# Altium schematic sheet Connector-side-2.SchDoc: =ProjectTitle
size 297 x 209 mm; Address1: Address1; Address2: Address2; Address3: Address3; Address4: Address4; SheetNumber: 3; SheetTotal: 6; Scale: 1:1; DocumentType: Схема электрическая принципиальная
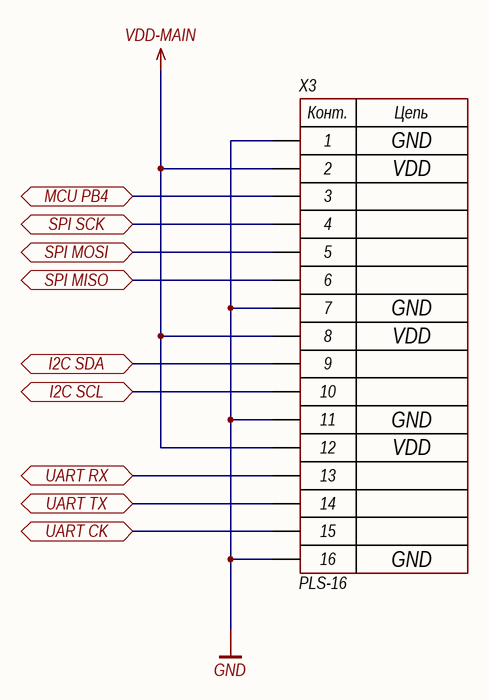
[diagram p0: Connector-side-2.SchDoc]

## Parts
X3  PLS-16  [CON: PLS-16]

## Ports
I2C SCL (bidir), I2C SDA (bidir), MCU PB4 (bidir), SPI MISO (bidir), SPI MOSI (bidir), SPI SCK (bidir), UART CK (bidir), UART RX (bidir), UART TX (bidir)

## Nets
GND: X3.1 X3.7 X3.11 X3.16
VDD-MAIN: X3.2 X3.8 X3.12
I2C SCL: X3.10 ; port I2C SCL
I2C SDA: X3.9 ; port I2C SDA
MCU PB4: X3.3 ; port MCU PB4
SPI MISO: X3.6 ; port SPI MISO
SPI MOSI: X3.5 ; port SPI MOSI
SPI SCK: X3.4 ; port SPI SCK
UART CK: X3.15 ; port UART CK
UART RX: X3.13 ; port UART RX
UART TX: X3.14 ; port UART TX

## Notes on the sheet
- GND
- VDD
- Изм.
- Лист
- № докум.
- Подп.
- Дата
- Копировал
- Формат А4
- (in symbol 16-Connector) Конт.; Цепь

## Library data of the parts
X3 = 16-Connector: Model: PLS-16; Manufacturer: *; HelpURL: *; ComponentKind: *